# Altium schematic sheet RVP_OVP_HC.SchDoc
size A
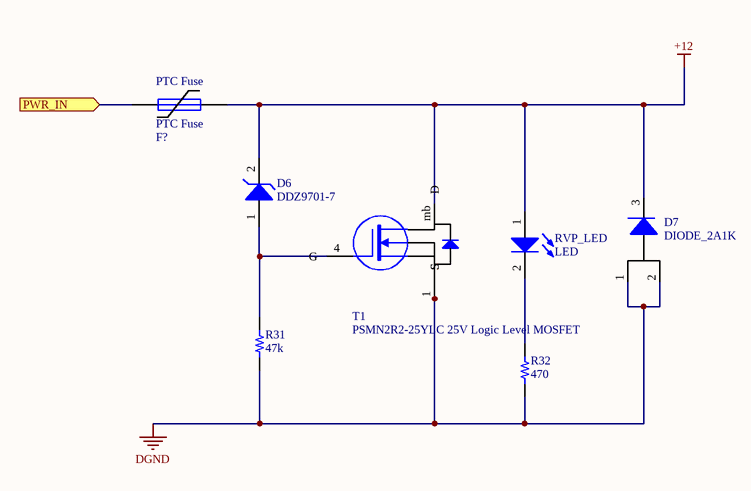
[diagram p0: RVP_OVP_HC.SchDoc]

## Parts
D6  DDZ9701-7  [SOD123F]
D7  DIODE_2A1K  [TO-277]
PTC_Fuse  PTC Fuse  I-hold: F?  [PTC Fuse 2920/07351]
R31  value 47k  [RES 0805/2012]  (hidden comment: Resistor 47k 0805 1/10W 1%)
R32  value 470  [RES 0805/2012]  (hidden comment: Resistor 470 0805 1/10W 1%)
RVP_LED  LED  [0805_LED]
T1  PSMN2R2-25YLC 25V Logic Level MOSFET  [LFPAK-SO8]

## Ports
PWR_IN (in)

## Nets
+12: D6.2(K) D7.3(K) PTC_Fuse.2 RVP_LED.1(A) T1.mb(D)
DGND: D7.1(A1) D7.2(A2) R31.1 R32.1 T1.1(S) T1.2(S) T1.3(S)
PWR_IN: PTC_Fuse.1 ; port PWR_IN
NetD6_1: D6.1(A) R31.2 T1.4(G)
NetR32_2: R32.2 RVP_LED.2(K)

## Library data of the parts
D6 = 10: Zener Diode 14V 500mW ±5% Surface Mount SOD-123; Manufacturer_id: 8; idDiode: 10; Drawer_id: 1; Value: 14Vz; MfrPartNo: DDZ9701-7; Name: DDZ9701; Type: Zener; Num_Circuits: 1; Power: 500mW; Package: SOD-123; Link: https://www.digikey.com/product-detail/en/diodes-incorporated/DDZ9701-7/DDZ9701-7DICT-ND/3877402; ComponentLink1Description: Datasheet; ComponentLink1URL: https://www.diodes.com/assets/Datasheets/ds30410.pdf; Supplier1: Digi-Key; Supplier1PartNo: DDZ9701-7DICT-ND
D7 = 11: Manufacturer_id: 1; idDiode: 11; Name: FSV20100V; Value: 20 A; Type: Schottky; Drawer_id: 1; Package: TO-277; MfrPartNo: FSV20100V; Link: https://www.digikey.com/product-detail/en/on-semiconductor/FSV20100V/FSV20100VCT-ND/5306682; ComponentLink1Description: Datasheet; ComponentLink1URL: https://www.fairchildsemi.com/datasheets/FS/FSV20100V.pdf; Supplier1PartNo: FSV20100VCT-ND
PTC_Fuse = 4: Fuse; Manufacturer_id: 1; MfrPartNo: 2920L200; idFuse: 4; Name: PTC Poly Fuse Resettable; Value: 2A hold, 4A trip, 40A max; I_hold: 2A; I_trip: 4A; I_max: 40A; Created_By: Eunice Bernardo; Published: 8-Jun-2000; LatestRevisionDate: 17-Jul-2002; LatestRevisionNote: Re-released for DXP Platform.; PackageReference: PIN-W2/E2.8; Publisher: Altium Limited; PackageDescription: Thru-Hole; 2 Leads; Drawer_id: 1; Link: https://www.digikey.com/product-detail/en/littelfuse-inc/2920L200-24DR/F2872TR-ND/1211346; Created_Date: 10/27/2018
R31 = 545: Manufacturer_id: 1; idResistor: 545; Name: Res_47k_0805_1/10W_1%; Created_By: Nick Mah; Supplier 1: Digi-Key; Drawer_id: 1; Tolerance: 1%; Power: 1/10W; Package: 0805; ComponentLink1Description: Datasheet; Created_Date: 2018-10-20
R32 = 497: Manufacturer_id: 1; idResistor: 497; Name: Res_470_0805_1/10W_1%; Created_By: Nick Mah; Supplier 1: Digi-Key; Drawer_id: 1; Tolerance: 1%; Power: 1/10W; Package: 0805; ComponentLink1Description: Datasheet; Created_Date: 2018-10-20
RVP_LED = 2: Manufacturer_id: 1; idLED: 2; Name: CMD17_0805_GREEN; Value: Green; Brightness: 7mcd; Id: 20mA; Vf: 2.1V; Drawer_id: 1; Package: 0805; Link: https://www.digikey.com/product-detail/en/visual-communications-company-vcc/CMD17-21VGD-TR8/L62505CT-ND/254936
T1 = 3: N-Channel 25V 100A (Tc) 106W (Tc) Surface Mount LFPAK56, Power-SO8; Manufacturer_id: 6; MfrPartNo: PSMN2R2-25YLC,115; idFETs: 3; Drawer_id: 1; Value: N_Channel; Rds_On: 2.5mOhm; Vgs(typ): 10V; Vgs(Max): 20V; Created_By: Nick; Name: PSMN2R2; Vdss: 25V; Num_Circuits: 1; Id: 100A; Package: LFPAK-SO8; Link: https://www.digikey.com/product-detail/en/nexperia-usa-inc/PSMN2R2-25YLC115/1727-5299-1-ND/2674299; ComponentLink1Description: Datasheet; ComponentLink1URL: https://assets.nexperia.com/documents/data-sheet/PSMN2R2-25YLC.pdf; Supplier1: Digi-Key; Supplier1PartNo: 1727-5299-1-ND